# EAGLE schematic MainBoard (EAGLE 9.6.1)

## Sheet 1 of 2
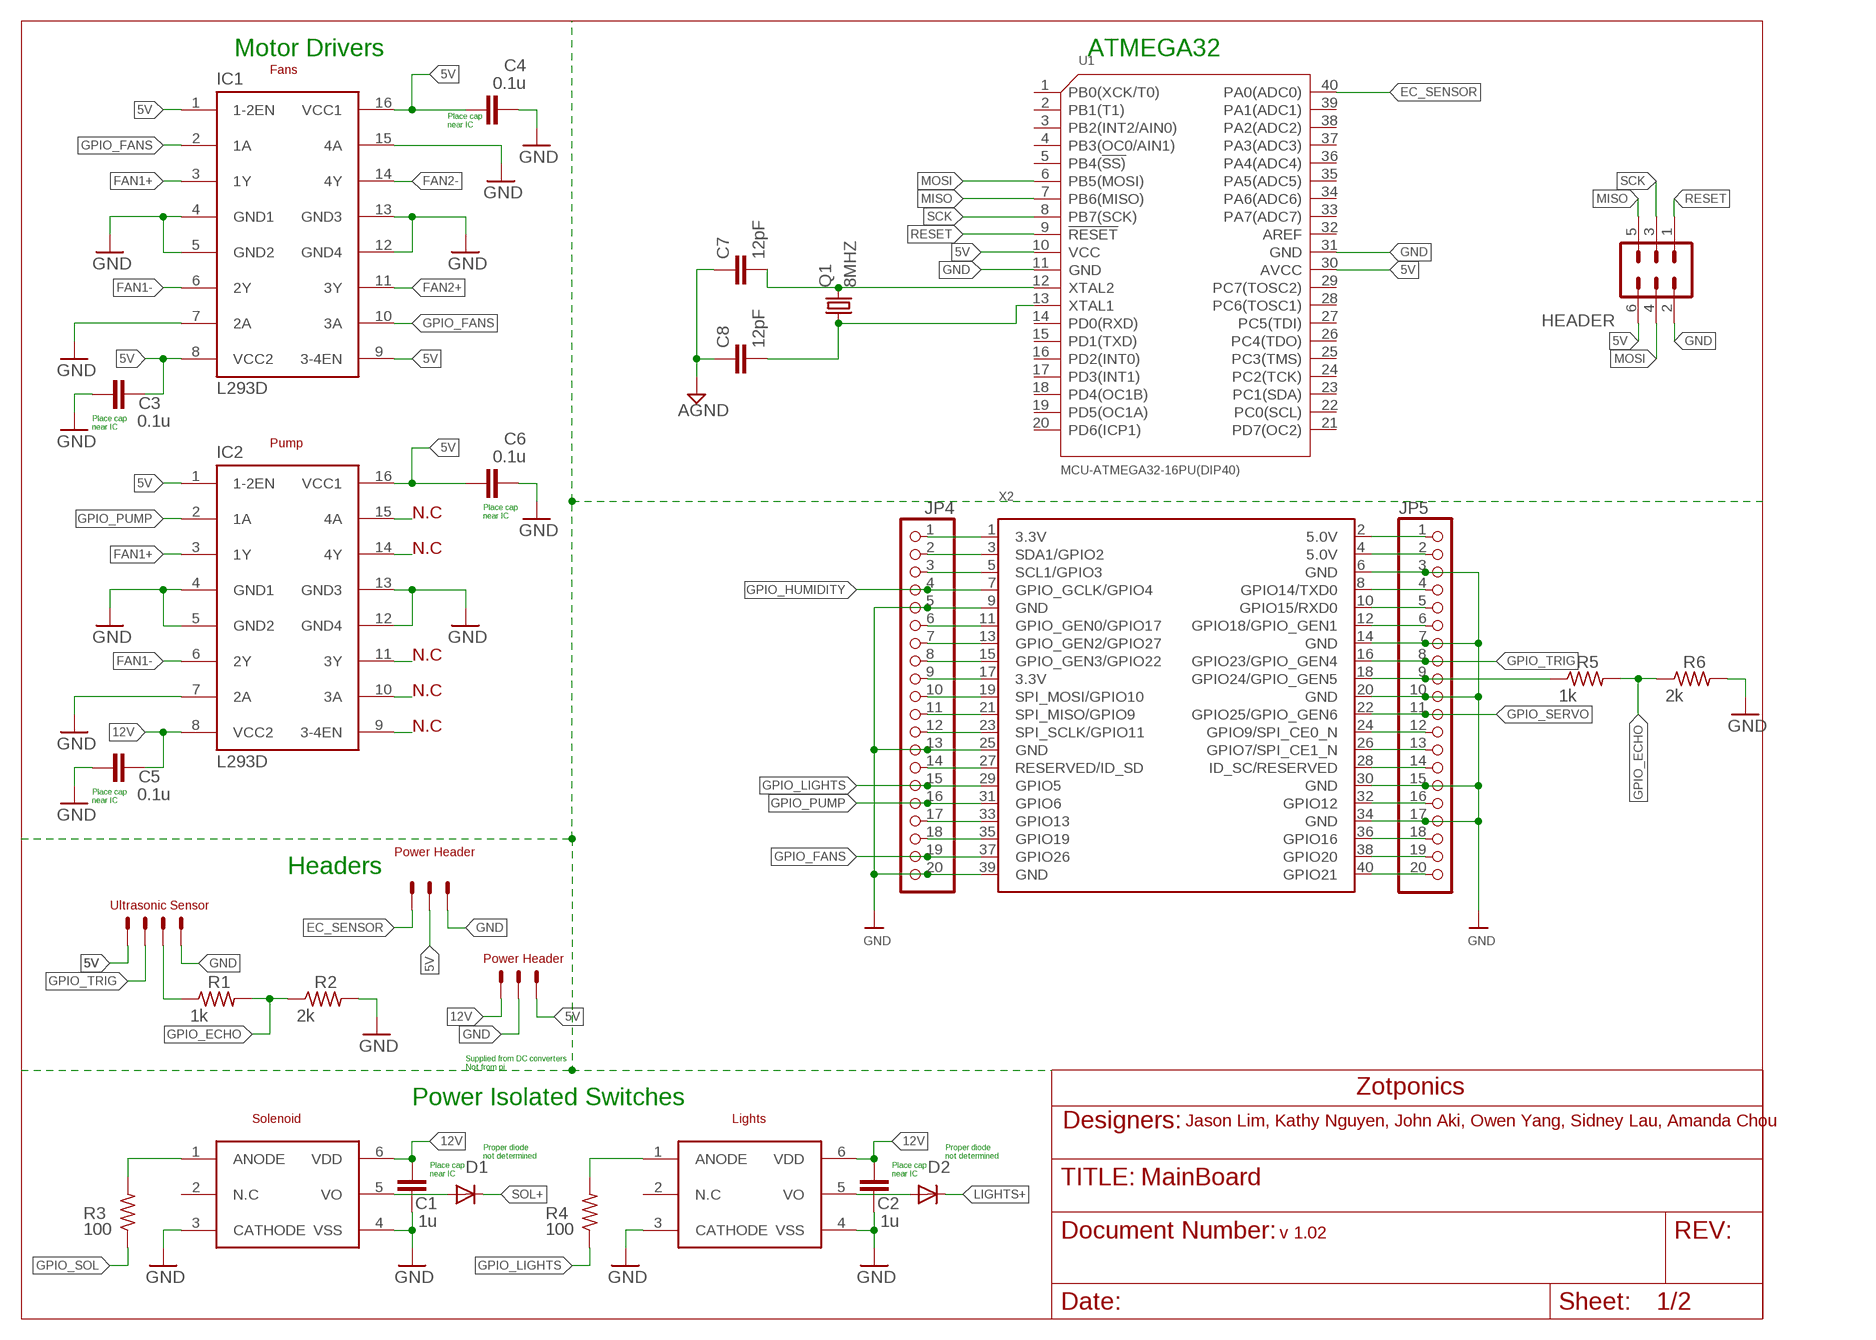
[diagram p0: schematic, sheet 1]

### Parts
C1  1u  C2,5-3  [C2.5-3]
C2  1u  C2,5-3  [C2.5-3]
C3  0.1u  C2,5-3  [C2.5-3]
C4  0.1u  C2,5-3  [C2.5-3]
C5  0.1u  C2,5-3  [C2.5-3]
C6  0.1u  C2,5-3  [C2.5-3]
C7  12pF  C2,5-3  [C2.5-3]
C8  12pF  C2,5-3  [C2.5-3]
D1  1N4004  [DO41-10]
D2  1N4004  [DO41-10]
HEADER  MA03-2  [MA03-2]
IC1  L293D  [DIL16]
IC2  L293D  [DIL16]
JP4  HEADER-1X20ROUND  [1X20_ROUND]
JP5  HEADER-1X20ROUND  [1X20_ROUND]
Q1  8MHZ  CRYSTALHC49S  [HC49/S]
R1  1k  R-US_0204/2V  [0204V]
R2  2k  R-US_0204/2V  [0204V]
R3  100  R-US_0204/2V  [0204V]
R4  100  R-US_0204/2V  [0204V]
R5  1k  R-US_0204/2V  [0204V]
R6  2k  R-US_0204/2V  [0204V]
U1  MCU-ATMEGA32-16PU(DIP40)  [DIP40-2.54-52.3X15.24MM]
U$1  FOD8343  [FOD8343]
U$3  FOD8343  [FOD8343]
X1  JST-XH-04-PIN-ROUND-PAD  [JST-XH-04-PACKAGE-ROUND-PAD]
X2  RASPBERRYPI_B+_IDC  [RASPBERRYPI_B+_IDC]
X3  JST-XH-03-PIN-ROUND-PAD  [JST-XH-03-PACKAGE-ROUND-PAD]
X4  JST-XH-03-PIN-ROUND-PAD  [JST-XH-03-PACKAGE-ROUND-PAD]

### Nets
5V: C3.2 C4.1 C6.1 HEADER.6 IC1.1(1-2EN) IC1.8(VCC2) IC1.9(3-4EN) IC1.16(VCC1) IC2.1(1-2EN) IC2.9(3-4EN) IC2.16(VCC1) U1.10(VCC) U1.30(AVCC) X1.1 X3.3 X4.2
12V: C1.2 C2.2 C5.2 IC2.8(VCC2) U$1.6(VDD) U$3.6(VDD) X3.1
EC_SENSOR: U1.40(PA0(ADC0)) X4.1
FAN1+: IC1.3(1Y) IC2.3(1Y)
FAN1-: IC1.6(2Y) IC2.6(2Y)
FAN2+: IC1.11(3Y) IC2.11(3Y)
FAN2-: IC1.14(4Y) IC2.14(4Y)
GND: C1.1 C2.1 C3.1 C4.2 C5.1 C6.2 HEADER.2 IC1.4(GND1) IC1.5(GND2) IC1.7(2A) IC1.12(GND4) IC1.13(GND3) IC2.4(GND1) IC2.5(GND2) IC2.7(2A) IC2.12(GND4) IC2.13(GND3) JP4.5 JP4.13 JP4.20 JP5.3 JP5.7 JP5.10 JP5.15 JP5.17 R2.2 R6.2 U1.11(GND) U1.31(GND) U$1.3(CATHODE) U$1.4(VSS) U$3.3(CATHODE) U$3.4(VSS) X1.4 X2.6(GND) X2.9(GND) X2.14(GND) X2.20(GND) X2.25(GND) X2.30(GND) X2.34(GND) X2.39(GND) X3.2 X4.3 ; also sheet 2
GPIO_ECHO: R1.2 R2.1 R5.2 R6.1
GPIO_FANS: IC1.2(1A) IC1.10(3A) IC2.10(3A) JP4.19 X2.37(GPIO26)
GPIO_HUMIDITY: JP4.4 X2.7(GPIO_GCLK/GPIO4)
GPIO_LIGHTS: JP4.15 R4.1 X2.29(GPIO5)
GPIO_PUMP: IC2.2(1A) JP4.16 X2.31(GPIO6)
GPIO_SERVO: JP5.11 X2.22(GPIO25/GPIO_GEN6)
GPIO_SOL: R3.1
GPIO_TRIG: JP5.8 X1.2 X2.16(GPIO23/GPIO_GEN4)
LIGHTS+: D2.C
MISO: HEADER.5 U1.7(PB6(MISO))
MOSI: HEADER.4 U1.6(PB5(MOSI))
N$1: R3.2 U$3.1(ANODE)
N$2: D2.A U$1.5(VO)
N$3: D1.A U$3.5(VO)
N$4: IC1.15(4A) ; supply symbol labelled GND
N$5: R4.2 U$1.1(ANODE)
N$6: IC2.15(4A)
N$8: JP5.2 X2.4(5.0V)
N$9: R1.1 X1.3
N$10: C7.2 Q1.2 U1.12(XTAL2)
N$11: C8.2 Q1.1 U1.13(XTAL1)
N$29: JP5.4 X2.8(GPIO14/TXD0)
N$30: JP5.5 X2.10(GPIO15/RXD0)
N$31: JP5.6 X2.12(GPIO18/GPIO_GEN1)
N$32: R5.1
N$33: JP5.9 X2.18(GPIO24/GPIO_GEN5)
N$34: C7.1 C8.1 ; supply symbol labelled AGND
N$35: JP5.12 X2.24(GPIO9/SPI_CE0_N)
N$36: JP5.13 X2.26(GPIO7/SPI_CE1_N)
N$37: JP5.14 X2.28(ID_SC/RESERVED)
N$38: JP5.16 X2.32(GPIO12)
N$39: JP5.18 X2.36(GPIO16)
N$40: JP5.19 X2.38(GPIO20)
N$41: JP5.20 X2.40(GPIO21)
N$42: JP4.1 X2.1(3.3V)
N$43: JP4.2 X2.3(SDA1/GPIO2)
N$44: JP4.3 X2.5(SCL1/GPIO3)
N$46: JP4.6 X2.11(GPIO_GEN0/GPIO17)
N$47: JP4.7 X2.13(GPIO_GEN2/GPIO27)
N$48: JP4.8 X2.15(GPIO_GEN3/GPIO22)
N$49: JP4.9 X2.17(3.3V)
N$50: JP4.10 X2.19(SPI_MOSI/GPIO10)
N$51: JP4.11 X2.21(SPI_MISO/GPIO9)
N$52: JP4.12 X2.23(SPI_SCLK/GPIO11)
N$53: JP4.14 X2.27(RESERVED/ID_SD)
N$56: JP4.17 X2.33(GPIO13)
N$57: JP4.18 X2.35(GPIO19)
N$59: JP5.1 X2.2(5.0V)
RESET: HEADER.1 U1.9(!RESET)
SCK: HEADER.3 U1.8(PB7(SCK))
SOL+: D1.C
Unconnected: U1.1(PB0(XCK/T0)) U1.2(PB1(T1)) U1.3(PB2(INT2/AIN0)) U1.4(PB3(OC0/AIN1)) U1.5(PB4(!SS)) U1.14(PD0(RXD)) U1.15(PD1(TXD)) U1.16(PD2(INT0)) U1.17(PD3(INT1)) U1.18(PD4(OC1B)) U1.19(PD5(OC1A)) U1.20(PD6(ICP1)) U1.21(PD7(OC2)) U1.22(PC0(SCL)) U1.23(PC1(SDA)) U1.24(PC2(TCK)) U1.25(PC3(TMS)) U1.26(PC4(TDO)) U1.27(PC5(TDI)) U1.28(PC6(TOSC1)) U1.29(PC7(TOSC2)) U1.32(AREF) U1.33(PA7(ADC7)) U1.34(PA6(ADC6)) U1.35(PA5(ADC5)) U1.36(PA4(ADC4)) U1.37(PA3(ADC3)) U1.38(PA2(ADC2)) U1.39(PA1(ADC1)) U$1.2(N.C) U$3.2(N.C)

### Notes on the sheet
- Motor Drivers | ATMEGA32
- Fans
- Place cap
  near IC
- Place cap
  near IC
- Pump
- N.C
- Place cap
  near IC
- N.C
- N.C
- N.C
- N.C
- Place cap
  near IC
- Power Header
- Headers
- Ultrasonic Sensor
- Power Header
- Supplied from DC converters
  Not from pi
- Zotponics
- Power Isolated Switches
- Solenoid | Lights | Jason Lim, Kathy Nguyen, John Aki, Owen Yang, Sidney Lau, Amanda Chou
- Designers:
- Proper diode
  not determined
- Proper diode
  not determined
- Place cap
  near IC
- Place cap
  near IC
- v 1.02

## Sheet 2 of 2
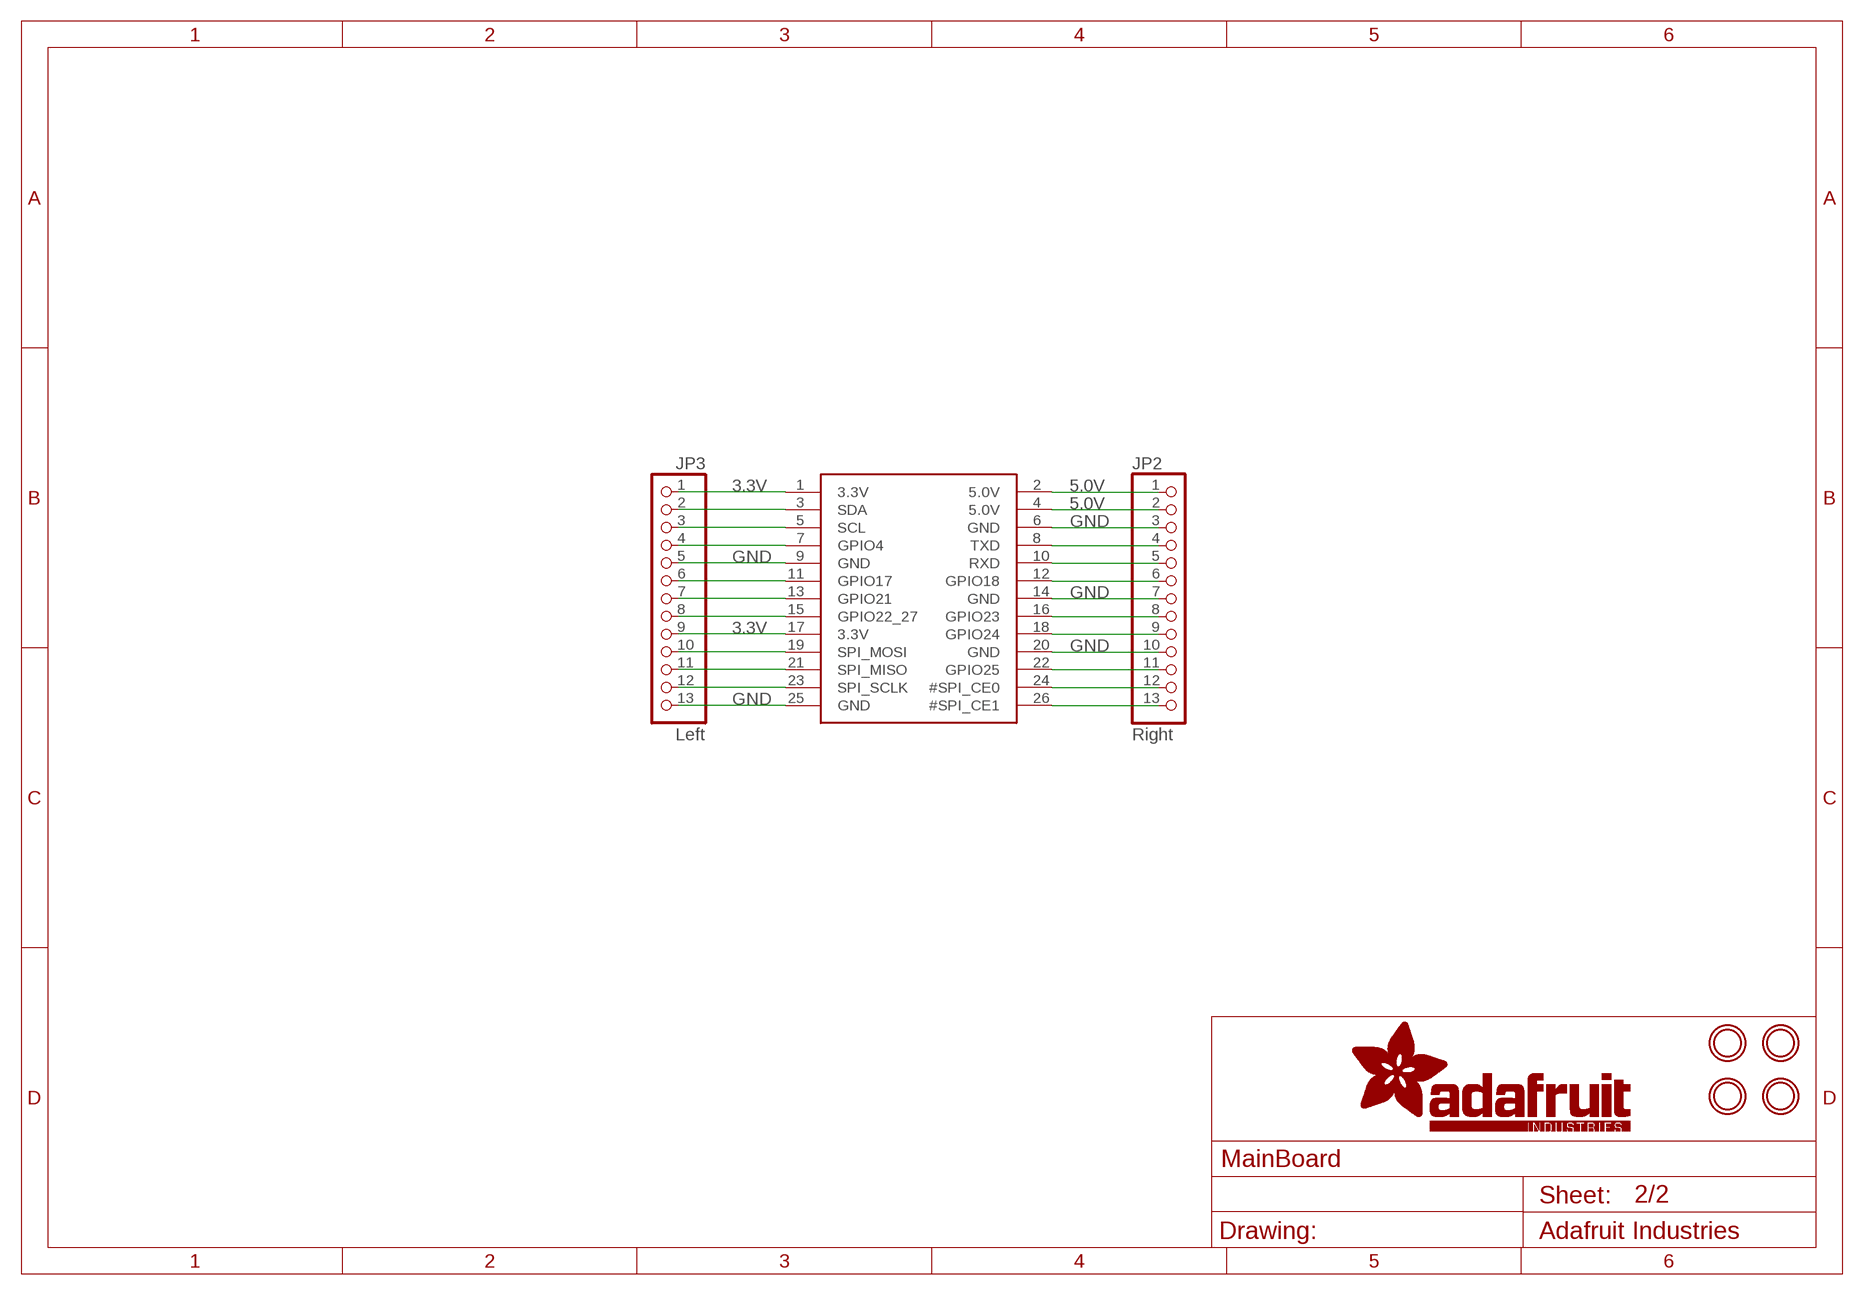
[diagram p1: schematic, sheet 2]

### Parts
JP1  PI  RASBERRYPI_IDC  [RASBERRYPI_IDC]
JP2  Right  HEADER-1X13  [1X13_ROUND_70]
JP3  Left  HEADER-1X13  [1X13_ROUND_70]
U$4  MOUNTINGHOLE2.5  [MOUNTINGHOLE_2.5_PLATED]
U$5  MOUNTINGHOLE2.5  [MOUNTINGHOLE_2.5_PLATED]
U$6  MOUNTINGHOLE2.5  [MOUNTINGHOLE_2.5_PLATED]
U$7  MOUNTINGHOLE2.5  [MOUNTINGHOLE_2.5_PLATED]

### Nets
3.3V: JP1.1(3.3V) JP1.17(3.3V) JP3.1 JP3.9
5.0V: JP1.2(5.0V) JP1.4(5.0V) JP2.1 JP2.2
GND: JP1.6(GND) JP1.9(GND) JP1.14(GND) JP1.20(GND) JP1.25(GND) JP2.3 JP2.7 JP2.10 JP3.5 JP3.13 ; also sheet 1
N$12: JP1.3(SDA) JP3.2
N$13: JP1.5(SCL) JP3.3
N$14: JP1.7(GPIO4) JP3.4
N$15: JP1.11(GPIO17) JP3.6
N$16: JP1.13(GPIO21) JP3.7
N$17: JP1.15(GPIO22_27) JP3.8
N$18: JP1.19(SPI_MOSI) JP3.10
N$19: JP1.21(SPI_MISO) JP3.11
N$20: JP1.23(SPI_SCLK) JP3.12
N$21: JP1.8(TXD) JP2.4
N$22: JP1.10(RXD) JP2.5
N$23: JP1.12(GPIO18) JP2.6
N$24: JP1.16(GPIO23) JP2.8
N$25: JP1.18(GPIO24) JP2.9
N$26: JP1.22(GPIO25) JP2.11
N$27: JP1.24(#SPI_CE0) JP2.12
N$28: JP1.26(#SPI_CE1) JP2.13

## Library data of the parts
C1-C8 = capacitor-wima:C: CAPACITOR naming: grid - package width
D1 D2 = adafruit:1N4004: DIODE General purpose 1N400x type rectifier (With bigger pads) http://www.ladyada.net/library/pcb/eaglelibrary.html
HEADER = con-lstb:MA03-2: PIN HEADER; OC_FARNELL: unknown; OC_NEWARK: unknown
IC1 IC2 = st-microelectronics:L293D: PUSH-PULL 4 CHANNEL DRIVER; MPN: L293D; OC_FARNELL: 9589619; OC_NEWARK: 56P8249
JP1 = microbuilder:RASBERRYPI_IDC: Rasberry PI IDC Header
JP2 JP3 = microbuilder:HEADER-1X13
JP4 JP5 = microbuilder:HEADER-1X20
Q1 = crystal:CRYSTAL: CRYSTAL; OC_FARNELL: 1667008; OC_NEWARK: unknown
R1-R6 = resistor:R-US_: RESISTOR, American symbol
U1 = MCU-ATMEGA32-16PU_DIP40_:MCU-ATMEGA32-16PU(DIP40): 310010127; AVAILABILITY: Unavailable; DESCRIPTION: AVR AVR® ATmega Microcontroller IC 8-Bit 16MHz 32KB _16K x 16_ FLASH 40-PDIP; MF: Microchip; MP: ATMEGA32-16PU; PACKAGE: DIP-40 Microchip; PRICE: None
U$1 U$3 = Zotponics:FOD8343
U$4-U$7 = microbuilder:MOUNTINGHOLE: Mounting Hole For #2 screws (0.086"/2.18mm width, 0.094"/2.4mm hole) use 2.5mm
X1 = Rembrandt Electronics - JST XH Connectors v1-0:JST-XH-04-PIN: JST XH Connector 2 Pin Wire to board connector. Pitch: 2,54 mm, (0.100") Number of pins: 4 Created by Rembrandt Electronics www.rembrandtelectronics.com
X2 = microbuilder:RASPBERRYPI_B+_IDC
X3 X4 = Rembrandt Electronics - JST XH Connectors v1-0:JST-XH-03-PIN: JST XH Connector 2 Pin Wire to board connector. Pitch: 2,54 mm, (0.100") Number of pins: 3 Created by Rembrandt Electronics www.rembrandtelectronics.com